# Altium schematic sheet LVDS_transceivers.SchDoc
size A4
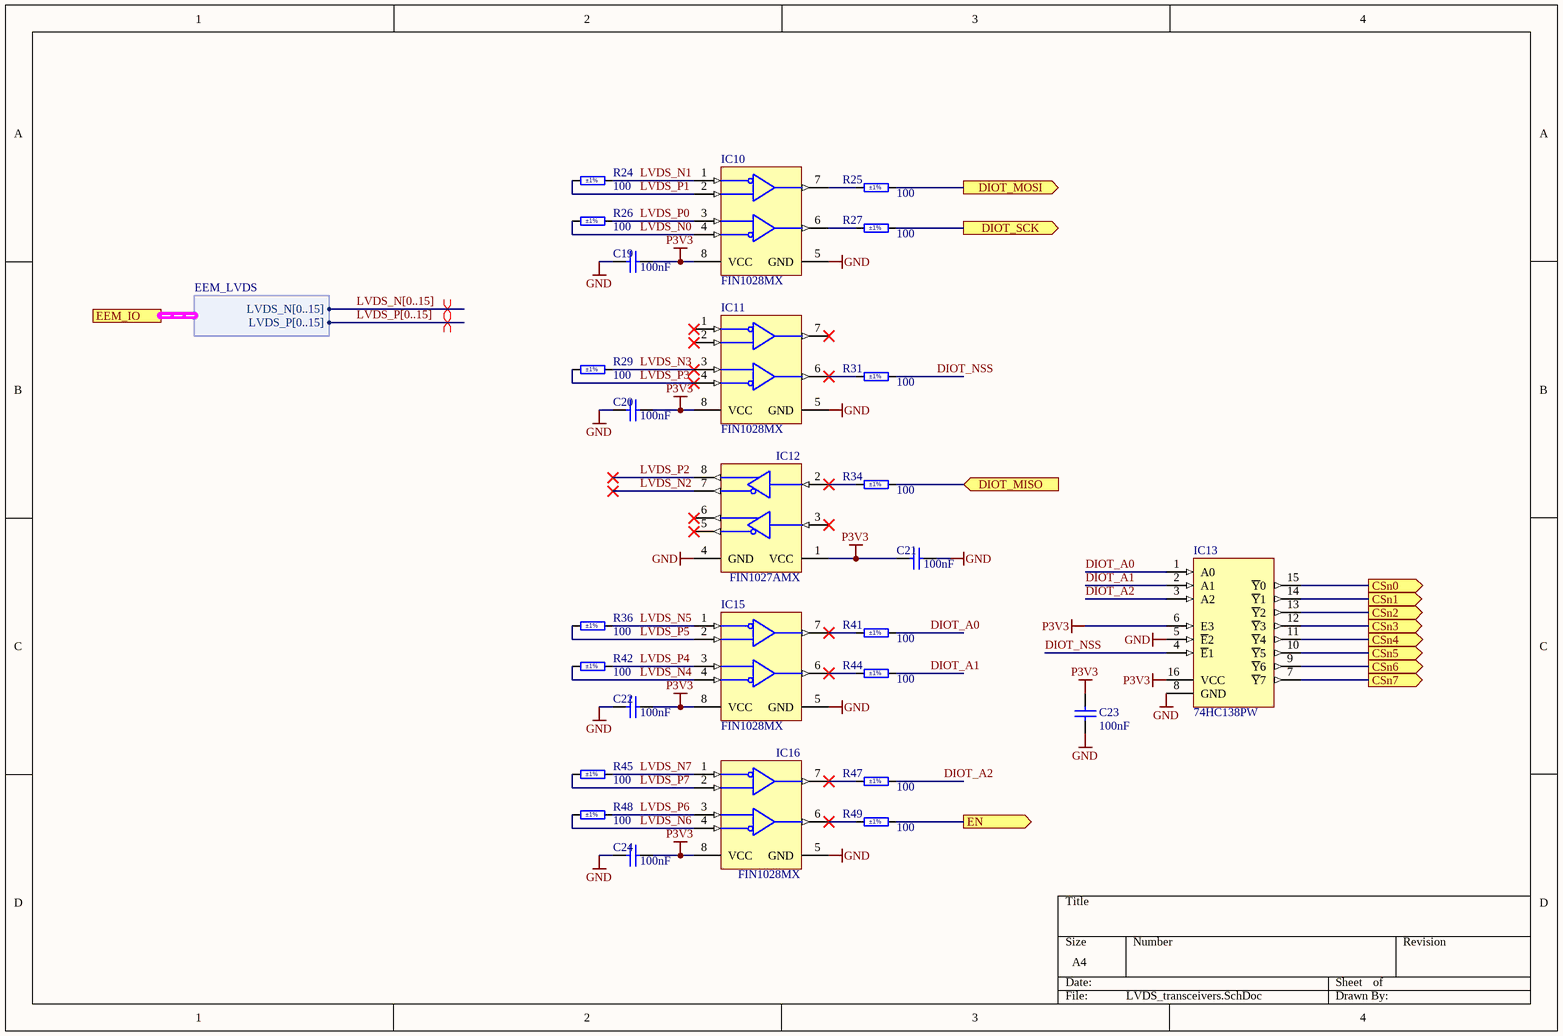
[diagram p0: LVDS_transceivers.SchDoc]

## Parts
C19  100nF  [CAPC1608X87N]
C20  100nF  [CAPC1608X87N]
C21  100nF  [CAPC1608X87N]
C22  100nF  [CAPC1608X87N]
C23  100nF  [CAPC1608X87N]
C24  100nF  [CAPC1608X87N]
IC10  FIN1028MX  [SOIC127P600X175-8N]
IC11  FIN1028MX  [SOIC127P600X175-8N]
IC12  FIN1027AMX  [SOIC127P600X175-8N]
IC13  74HC138PW  [SOP65P640X110-16N]
IC15  FIN1028MX  [SOIC127P600X175-8N]
IC16  FIN1028MX  [SOIC127P600X175-8N]
R24  100  Tolerance: ±1%  [RESC1608X55N]
R25  100  Tolerance: ±1%  [RESC1608X55N]
R26  100  Tolerance: ±1%  [RESC1608X55N]
R27  100  Tolerance: ±1%  [RESC1608X55N]
R29  100  Tolerance: ±1%  [RESC1608X55N]
R31  100  Tolerance: ±1%  [RESC1608X55N]
R34  100  Tolerance: ±1%  [RESC1608X55N]
R36  100  Tolerance: ±1%  [RESC1608X55N]
R41  100  Tolerance: ±1%  [RESC1608X55N]
R42  100  Tolerance: ±1%  [RESC1608X55N]
R44  100  Tolerance: ±1%  [RESC1608X55N]
R45  100  Tolerance: ±1%  [RESC1608X55N]
R47  100  Tolerance: ±1%  [RESC1608X55N]
R48  100  Tolerance: ±1%  [RESC1608X55N]
R49  100  Tolerance: ±1%  [RESC1608X55N]

## Ports
CSn0 (out), CSn1 (out), CSn2 (out), CSn3 (out), CSn4 (out), CSn5 (out), CSn6 (out), CSn7 (out), DIOT_MISO (in), DIOT_MOSI (out), DIOT_SCK (out), EEM_IO (harness EEM_LVDS), EN (out)

## Harnesses
EEM_LVDS: LVDS_P[0..15], LVDS_N[0..15]

## Nets
GND: C19.2 C20.2 C21.1 C22.2 C23.1 C24.2 IC10.5(GND) IC11.5(GND) IC12.4(GND) IC13.5(~{E}2) IC13.8(GND) IC15.5(GND) IC16.5(GND)
P3V3: C19.1 C20.1 C21.2 C22.1 C23.2 C24.1 IC10.8(VCC) IC11.8(VCC) IC12.1(VCC) IC13.6(E3) IC13.16(VCC) IC15.8(VCC) IC16.8(VCC)
CSn0: IC13.15(~{Y}0) ; port CSn0
CSn1: IC13.14(~{Y}1) ; port CSn1
CSn2: IC13.13(~{Y}2) ; port CSn2
CSn3: IC13.12(~{Y}3) ; port CSn3
CSn4: IC13.11(~{Y}4) ; port CSn4
CSn5: IC13.10(~{Y}5) ; port CSn5
CSn6: IC13.9(~{Y}6) ; port CSn6
CSn7: IC13.7(~{Y}7) ; port CSn7
DIOT_A0: IC13.1(A0) R41.1
DIOT_A1: IC13.2(A1) R44.1
DIOT_A2: IC13.3(A2) R47.1
DIOT_MISO: R34.1 ; port DIOT_MISO
DIOT_MOSI: R25.1 ; port DIOT_MOSI
DIOT_NSS: IC13.4(~{E}1) R31.1
DIOT_SCK: R27.1 ; port DIOT_SCK
EN: R49.1 ; port EN
LVDS_N0: IC10.4(RIN2-) R26.2
LVDS_N1: IC10.1(RIN1-) R24.1
LVDS_N2: IC12.7(DOUT-)
LVDS_N3: IC11.3(RIN2+) R29.1
LVDS_N4: IC15.4(RIN2-) R42.2
LVDS_N5: IC15.1(RIN1-) R36.1
LVDS_N6: IC16.4(RIN2-) R48.2
LVDS_N7: IC16.1(RIN1-) R45.1
LVDS_P0: IC10.3(RIN2+) R26.1
LVDS_P1: IC10.2(RIN1+) R24.2
LVDS_P2: IC12.8(DOUT+)
LVDS_P3: IC11.4(RIN2-) R29.2
LVDS_P4: IC15.3(RIN2+) R42.1
LVDS_P5: IC15.2(RIN1+) R36.2
LVDS_P6: IC16.3(RIN2+) R48.1
LVDS_P7: IC16.2(RIN1+) R45.2
NetIC10_6: IC10.6(ROUT2) R27.2
NetIC10_7: IC10.7(ROUT1) R25.2
NetIC11_6: IC11.6(ROUT2) R31.2
NetIC12_2: IC12.2(DIN1) R34.2
NetIC15_6: IC15.6(ROUT2) R44.2
NetIC15_7: IC15.7(ROUT1) R41.2
NetIC16_6: IC16.6(ROUT2) R49.2
NetIC16_7: IC16.7(ROUT1) R47.2

Not connected (* = marked no-connect by the designer): IC11 1(RIN1-)* 2(RIN1+)* 7(ROUT1)*; IC12 3(DIN2RIN-)* 5(DOUT-)* 6(DOUT+)*

## Buses and harness runs
bus LVDS_N[0..15]
bus LVDS_P[0..15]

## Layout directives
differential pair; differential pair class Diff_100Ohm: (no net found under the mark)

## Library data of the parts
C19-C24 = CC0603_100NF_50V_10%_X7R: Non-polarised capacitor; Part Description: SMD Multilayer Chip Ceramic Capacitor; Manufacturer: GENERIC; Manufacturer1 Part Number: 223858615649; Voltage: 50V; TC: X7R; Tolerance: ±10%; Part Number: CC0603_100NF_50V_10%_X7R; Component Kind: Standard; Component Type: Standard; Pin Count: 2; Value: 100nF; Status: Preferred; Manufacturer Part Number: CC0603_100NF_50V_10%_X7R; Case: 0603; Mounted: Yes; Socket: No; SMD: Yes; Sense: No; Manufacturer1 Example: PHYCOMP; Manufacturer1 ComponentHeight: 0.87mm; HelpURL: \\cern.ch\dfs\Applications\Altium\Datasheets\CC0603_X7R_PHYCOMP.pdf; Author: CERN DEM JLC; CreateDate: 03.12.2007; LatestRevisionDate: 03.12.2007
IC10 IC11 IC15 IC16 = IFC_FIN1028: 3.3V LVDS 2-Bit High-Speed Differential Reciever; Manufacturer: ON Semiconductor; PressFit: No; Bonding: No; Part Number: FIN1028MX; Component Kind: Standard; Component Type: Standard; Device: FIN1028MX; PackageDescription: SOIC 8, Pitch 1.27mm - Body 4x5mm, IPC Medium Density; Part Description: 3.3V LVDS 2-Bit High-Speed Differential Reciever; Manufacturer Part Number: FIN1028MX; Pin Count: 8; Case: SOIC8; Mounted: Yes; Socket: No; SMD: Yes; Sense: No; ComponentHeight: 0.8mm; Author: GK; HelpURL: \\cern.ch\dfs\Applications\Altium\Datasheets\FIN1101K8X.pdf; CreateDate: 08/11/2016; LatestRevisionDate: 08/11/2016
IC12 = IFC_FIN1027A: 3.3V LVDS, 2-Bit, High-Speed, Differential Driver; Manufacturer: ON Semiconductor; PressFit: No; Bonding: No; Part Number: FIN1027AMX; Component Kind: Standard; Component Type: Standard; Device: FIN1027AMX; PackageDescription: SOIC 8, Pitch 1.27mm - Body 4x5mm, IPC Medium Density; Part Description: 3.3V LVDS, 2-Bit, High-Speed, Differential Driver; Manufacturer Part Number: FIN1027AMX; Pin Count: 8; Case: SOIC8; Mounted: Yes; Socket: No; SMD: Yes; Sense: No; ComponentHeight: 0.8mm; Author: GK; HelpURL: \\cern.ch\dfs\Applications\Altium\Datasheets\FIN1101K8X.pdf; CreateDate: 08/11/2016; LatestRevisionDate: 08/11/2016
IC13 = 74HC138PW: 3-Line to 8-Line Decoder/Demultiplexer; Part Description: 3-Line to 8-Line Decoder/Demultiplexer, Inverting; Manufacturer: NXP SEMICONDUCTORS; PressFit: No; Bonding: No; Part Number: 74HC138PW; Component Kind: Standard; Component Type: Standard; Device: 74HC138PW; PackageDescription: SOP, 0.65mm Pitch; 16 Pin, 4.40mm W X 5.00mm L X 1.10mm H body IPC Medium Density; Manufacturer Part Number: 74HC138PW; Pin Count: 16; Case: TSSOP16; Mounted: Yes; Socket: No; SMD: Yes; Sense: No; ComponentHeight: 1.1mm; Author: CERN DEM JLC; HelpURL: \\cern.ch\dfs\Applications\Altium\Datasheets\74HC138PW.pdf; CreateDate: 09.06.2015; LatestRevisionDate: 09.06.2015
R24-R27 R29 R31 R34 R36 R41 R42 R44 R45 R47-R49 = R0603_100R_1%_0.1W_100PPM: Resistor - 1%; Part Description: General Purpose Thick Film Chip Resistor; Manufacturer: GENERIC; Manufacturer1 Part Number: NRC06F4700TRF; Power: 0.1W; TC: ±100ppm/°C; PressFit: No; Part Number: R0603_100R_1%_0.1W_100PPM; Component Kind: Standard; Component Type: Standard; Pin Count: 2; Value: 100; Status: Preferred; Manufacturer Part Number: R0603_100R_1%_0.1W_100PPM; Case: 0603; Mounted: Yes; Sense: No; Socket: No; SMD: Yes; Manufacturer1 Example: NIC COMPONENT; Manufacturer1 ComponentHeight: 0.55mm; HelpURL: \\cern.ch\dfs\Applications\Altium\Datasheets\R0603_NIC_NRC.pdf; Author: CERN DEM JLC; CreateDate: 03.12.2007; LatestRevisionDate: 13.03.2008